# Altium schematic sheet SSBtag_afe.SchDoc
size A4
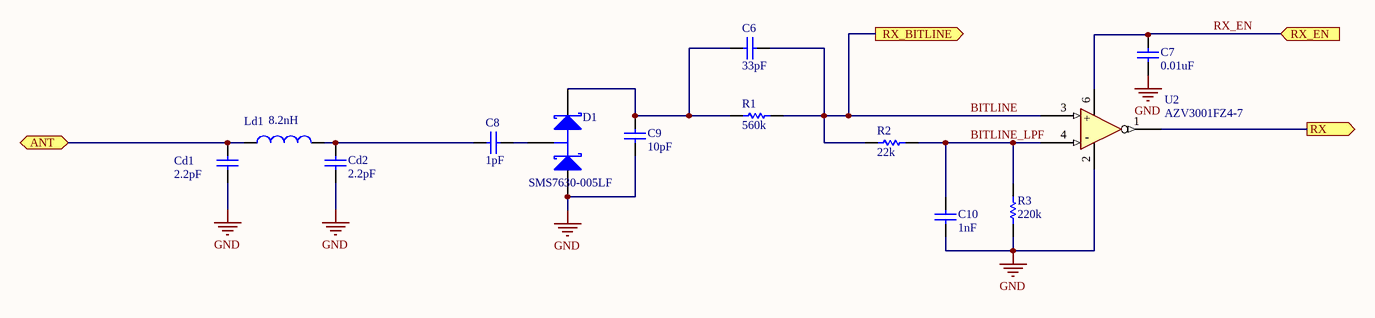
[diagram p0: SSBtag_afe.SchDoc]

## Parts
C6  value 33pF  [0402]  (hidden comment: GCQ1555C1H330JB01D)
C7  value 0.01uF  [0402]  (hidden comment: GCM155R71H103KA55D)
C8  value 1pF  [0402]  (hidden comment: GCQ1555C1H1R0WB01D)
C9  value 10pF  [0402]  (hidden comment: GCQ1555C1H100FB01D)
C10  value 1nF  [0402]  (hidden comment: GCM1555C1H102JA16J)
Cd1  value 2.2pF  [0402]  (hidden comment: GJM1555C1H1R0WB01D)
Cd2  value 2.2pF  [0402]  (hidden comment: GJM1555C1H1R0WB01D)
D1  SMS7630-005LF  [SOT23]
Ld1  value 8.2nH  [0402]  (hidden comment: LQW15AN6N6G8ZD)
R1  value 560k  [0402]  (hidden comment: CRCW0402560KFKED)
R2  value 22k  [0402]  (hidden comment: CRCW040222K0FKEDC)
R3  value 220k  [0402]  (hidden comment: CRCW0402220KFKED)
U2  AZV3001FZ4-7  [X2DFN1410-6]

## Ports
ANT (bidir), RX (out), RX_BITLINE (out), RX_EN (in)

## Nets
GND: C7.1 C9.1 C10.1 Cd1.1 Cd2.1 D1.1(A) R3.1 U2.2(Gnd)
ANT: Cd1.2 Ld1.1 ; port ANT
BITLINE: C6.2 R1.2 R2.1 U2.3(IN+) ; port RX_BITLINE
BITLINE_LPF: C10.2 R2.2 R3.2 U2.4(In-)
RX: U2.1(OUT) ; port RX
RX_EN: C7.2 U2.6(VDD) ; port RX_EN
NetC6_1: C6.1 C9.2 D1.2(K) R1.1
NetC8_1: C8.1 Cd2.2 Ld1.2
NetC8_2: C8.2 D1.3(C)

## Notes on the sheet
- (in symbol AZV3001FZ4-7) +; -

## Library data of the parts
C6-C10 Cd1 Cd2 = Cap: Ceramic Capacitor (Surface Mount); Manufacturer: Generic Ceramic Chip Cap (TBD); Digi-Key Part Number: *; Manufacturer Part Number: *; Note: *; Rating: *
D1 = SMS7630-005LF: Schottky Diode, Two in Series, Small Package SOT-23; Manufacturer: Skyworks; Note: *; Manufacturer Part Number: SMS7630-005LF; Rating: *; Value: *
Ld1 = Ind: Inductor (Surface Mount); Digi-Key Part Number: *; Manufacturer: *; Manufacturer Part Number: *; Rating: *; Note: *
R1-R3 = Res: Chip Resistor (Surface Mount); Manufacturer: Generic Chip Res (TBD); Manufacturer Part Number: *; Digi-Key Part Number: *; Rating: *